# EAGLE design 8bit-quad-fc (EAGLE 8.4.1)
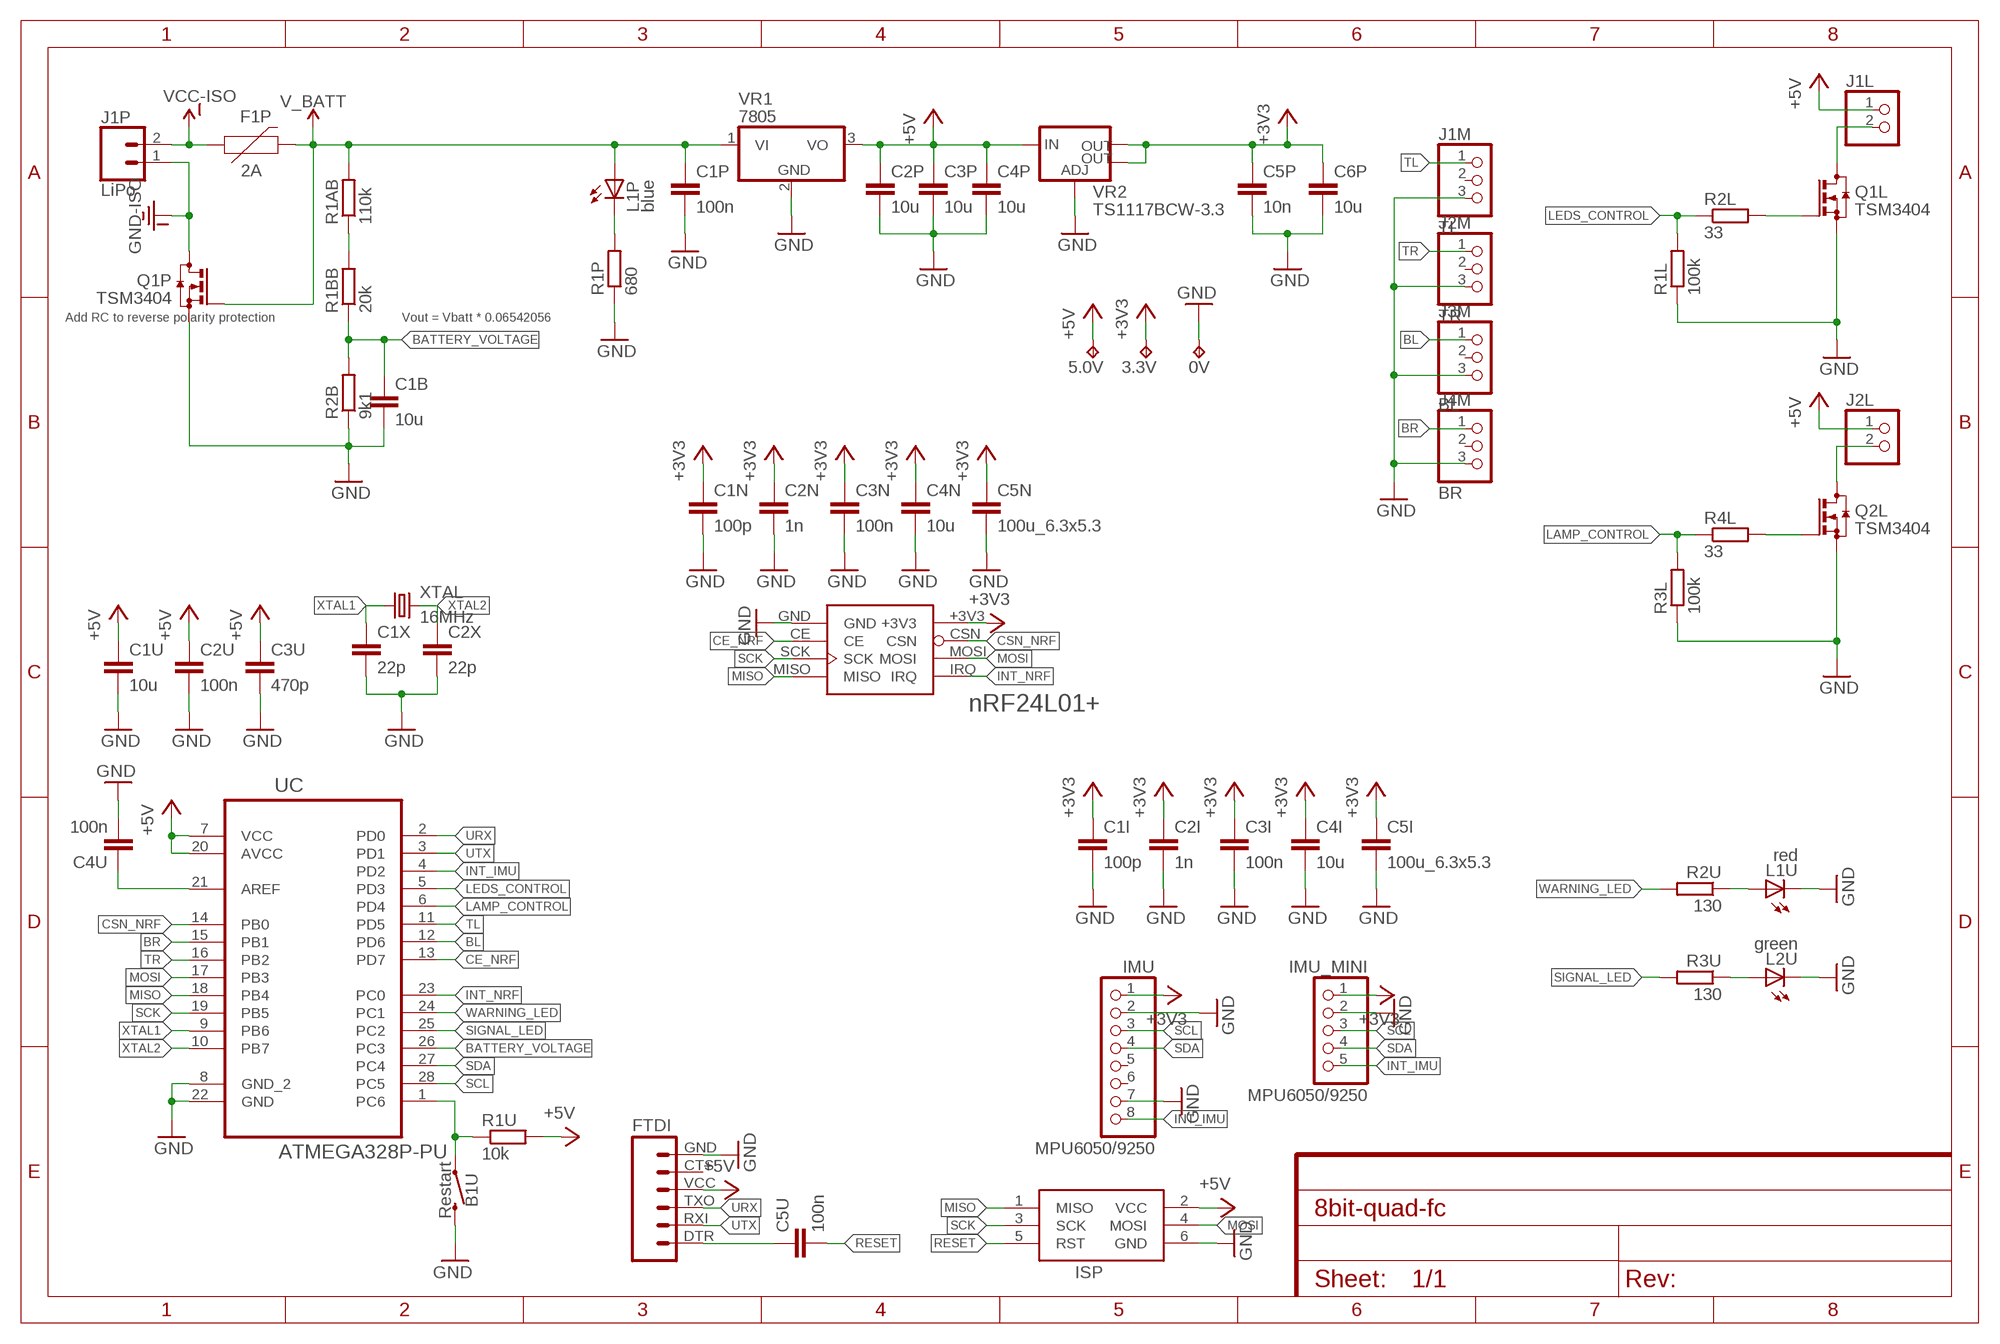
[diagram p0: schematic, sheet 1]

## Parts
0V  TPTP10SQ  [TP10SQ]
3.3V  TPTP10SQ  [TP10SQ]
5.0V  TPTP10SQ  [TP10SQ]
B1U  Restart  MOMENTARY-SWITCH-SPST-PTH-6.0MM  [TACTILE_SWITCH_PTH_6.0MM]
C1B  10u  C-EUC1206  [C1206]
C1I  100p  C-EUC1206  [C1206]
C1N  100p  C-EUC1206  [C1206]
C1P  100n  C-EUC1206  [C1206]
C1U  10u  C-EUC1206  [C1206]
C1X  22p  C-EUC1206  [C1206]
C2I  1n  C-EUC1206  [C1206]
C2N  1n  C-EUC1206  [C1206]
C2P  10u  C-EUC1206  [C1206]
C2U  100n  C-EUC1206  [C1206]
C2X  22p  C-EUC1206  [C1206]
C3I  100n  C-EUC1206  [C1206]
C3N  100n  C-EUC1206  [C1206]
C3P  10u  C-EUC1206  [C1206]
C3U  470p  C-EUC1206  [C1206]
C4I  10u  C-EUC1206  [C1206]
C4N  10u  C-EUC1206  [C1206]
C4P  10u  C-EUC1206  [C1206]
C4U  100n  C-EUC1206  [C1206]
C5I  100u_6.3x5.3  C-EUC3225  [C3225]
C5N  100u_6.3x5.3  C-EUC3225  [C3225]
C5P  10n  C-EUC1206  [C1206]
C5U  100n  C-EUC1206  [C1206]
C6P  10u  C-EUC1206  [C1206]
F1P  2A  PPTC_HALF-AMP  [1206]
FTDI  FTDI_BASICPTH  [FTDI_BASIC]
IMU  MPU6050/9250  PINHD-1X8_2.54  [1X08]
IMU_MINI  MPU6050/9250  PINHD-1X5  [1X05]
ISP  AVRISP-6  [AVRISP]
J1L  PINHD-1X2/90  [1X02/90]
J1M  TL  PINHD-1X3/90  [1X03/90]
J1P  LiPo  CONN_02JST-PTH-2  [JST-2-PTH]
J2L  PINHD-1X2/90  [1X02/90]
J2M  TR  PINHD-1X3/90  [1X03/90]
J3M  BL  PINHD-1X3/90  [1X03/90]
J4M  BR  PINHD-1X3/90  [1X03/90]
L1P  blue  LEDSMT1206  [1206]
L1U  red  LEDSMT1206  [1206]
L2U  green  LEDSMT1206  [1206]
NRF24L01+  nRF24L01+  NRF24L01+_PA_LNA_BREAKOUT_SMD  [NRF24L01+_PA_LNA_SMD]
Q1L  TSM3404  BSS123  [SOT23]
Q1P  TSM3404  BSS123  [SOT23]
Q2L  TSM3404  BSS123  [SOT23]
R1AB  110k  R-EU_R1206  [R1206]
R1BB  20k  R-EU_R1206  [R1206]
R1L  100k  R-EU_R1206  [R1206]
R1P  680  R-EU_R1206  [R1206]
R1U  10k  R-EU_R1206  [R1206]
R2B  9k1  R-EU_R1206  [R1206]
R2L  33  R-EU_R1206  [R1206]
R2U  130  R-EU_R1206  [R1206]
R3L  100k  R-EU_R1206  [R1206]
R3U  130  R-EU_R1206  [R1206]
R4L  33  R-EU_R1206  [R1206]
UC  ATMEGA328P-PU  [DIP254P762X457-28]
VR1  7805  7805TV  [TO220V]
VR2  TS1117BCW-3.3  V_REG_LM1117SOT223  [SOT223]
XTAL  16MHz  CRYSTALHC49S  [HC49/S]

## Nets
+3V3: 3.3V.TP C1I.1 C1N.1 C2I.1 C2N.1 C3I.1 C3N.1 C4I.1 C4N.1 C5I.1 C5N.1 C5P.1 C6P.1 IMU.1 IMU_MINI.1 NRF24L01+.+3V3 VR2.2(OUT) VR2.4(OUT)
+5V: 5.0V.TP C1U.1 C2P.1 C2U.1 C3P.1 C3U.1 C4P.1 FTDI.VCC ISP.2(VCC) J1L.1 J2L.1 R1U.2 UC.7(VCC) UC.20(AVCC) VR1.3(VO) VR2.3(IN)
BATTERY_VOLTAGE: C1B.1 R1BB.1 R2B.2 UC.26(PC3)
BL: J3M.1 UC.12(PD6)
BR: J4M.1 UC.15(PB1)
CE_NRF: NRF24L01+.CE UC.13(PD7)
CSN_NRF: NRF24L01+.CSN UC.14(PB0)
GND: 0V.TP B1U.3 C1B.2 C1I.2 C1N.2 C1P.2 C1U.2 C1X.2 C2I.2 C2N.2 C2P.2 C2U.2 C2X.2 C3I.2 C3N.2 C3P.2 C3U.2 C4I.2 C4N.2 C4P.2 C4U.2 C5I.2 C5N.2 C5P.2 C6P.2 FTDI.GND IMU.2 IMU.7 IMU_MINI.2 ISP.6(GND) J1M.3 J2M.3 J3M.3 J4M.3 L1U.C L2U.C NRF24L01+.GND Q1L.2(S) Q1P.2(S) Q2L.2(S) R1L.1 R1P.1 R2B.1 R3L.1 UC.8(GND_2) UC.22(GND) VR1.2(GND) VR2.1(ADJ)
GND-ISO: J1P.1 Q1P.3(D)
INT_IMU: IMU.8 IMU_MINI.5 UC.4(PD2)
INT_NRF: NRF24L01+.IRQ UC.23(PC0)
LAMP_CONTROL: R3L.2 R4L.1 UC.6(PD4)
LAMP_SINK: J2L.2 Q2L.3(D)
LEDS_CONTROL: R1L.2 R2L.1 UC.5(PD3)
LEDS_SINK: J1L.2 Q1L.3(D)
MISO: ISP.1(MISO) NRF24L01+.MISO UC.18(PB4)
MOSI: ISP.4(MOSI) NRF24L01+.MOSI UC.17(PB3)
N$1: L2U.A R3U.1
N$2: R1AB.1 R1BB.2
N$3: L1U.A R2U.1
N$4: Q1L.1(G) R2L.2
N$6: Q2L.1(G) R4L.2
N$27: L1P.C R1P.2
N$35: C4U.1 UC.21(AREF)
N$36: C5U.1 FTDI.DTR
RESET: B1U.1 C5U.2 ISP.5(RST) R1U.1 UC.1(PC6)
SCK: ISP.3(SCK) NRF24L01+.SCK UC.19(PB5)
SCL: IMU.3 IMU_MINI.3 UC.28(PC5)
SDA: IMU.4 IMU_MINI.4 UC.27(PC4)
SIGNAL_LED: R3U.2 UC.25(PC2)
TL: J1M.1 UC.11(PD5)
TR: J2M.1 UC.16(PB2)
URX: FTDI.TXO UC.2(PD0)
UTX: FTDI.RXI UC.3(PD1)
V_BATT: C1P.1 F1P.2 L1P.A Q1P.1(G) R1AB.2 VR1.1(VI)
VCC-ISO: F1P.1 J1P.2
WARNING_LED: R2U.2 UC.24(PC1)
XTAL1: C1X.1 UC.9(PB6) XTAL.1
XTAL2: C2X.1 UC.10(PB7) XTAL.2
Unconnected: FTDI.CTS IMU.5 IMU.6 J1M.2 J2M.2 J3M.2 J4M.2

## Notes on the sheet
- Add RC to reverse polarity protection | Vout = Vbatt * 0.06542056
- nRF24L01+

## Library data of the parts
0V 3.3V 5.0V = testpad:TP: Test pad
B1U = SparkFun-Switches:MOMENTARY-SWITCH-SPST: Momentary Switch (Pushbutton) - SPST Normally-open (NO) SPST momentary switches (buttons, pushbuttons). Variants PTH-12MM - 12mm square, through-hole Momentary Pushbutton Switch - 12mm Square <https://www.sparkfun.com/products/9190> (COM-09190) PTH-6.0MM, PTH-6.0MM-KIT - 6.0mm square, through-hole Mini Pushbutton Switch <https://www.sparkfun.com/products/97> (COM-00097) KIT package intended for soldering kit's - only one side of pads' copper is exposed. PTH-RIGHT-ANGLE-KIT - Right-angle, through-hole Right Angle Tactile Button <https://www.sparkfun.com/products/10791> - Used on SparkFun BigTime Watch Kit <https://www.sparkfun.com/products/11734> SMD-12MM - 12mm square, surface-mount Tactile Button - SMD (12mm) <https://www.sparkfun.com/products/12993> (COM-12993) Used on SparkFun PicoBoard <https://www.sparkfun.com/products/11888> SMD-4.5MM - 4.5mm Square Trackball Switch Used on SparkFun Blackberry Trackballer Breakout <https://www.sparkfun.com/products/13169> SMD-4.6MMX2.8MM - 4.60mm x 2.80mm, surface mount Used on SparkFun SAMD21 Mini Breakout <https://www.sparkfun.com/products/13664> SMD-5.2MM, SMD-5.2-REDUNDANT - 5.2mm square, surface-mount Mini Pushbutton Switch - SMD <https://www.sparkfun.com/products/8720> (COM-08720) Used on Arduino Pro Mini <https://www.sparkfun.com/products/11114> REDUNDANT package connects both switch circuits together SMD-6.0X3.5MM - 6.0 x 3.5mm, surface mount Momentary Reset Switch SMD <https://www.sparkfun.com/products/8229> (COM-08229) SMD-6.2MM-TALL - 6.2mm square, surface mount Tactile Button - SMD (6mm) <https://www.sparkfun.com/products/12992> Used on SparkFun Digital Sandbox <https://www.sparkfun.com/products/12651> SMD-RIGHT-ANGLE - Right-angle, surface mount Used on SparkFun Block for Intel® Edison - Arduino <https://www.sparkfun.com/products/13036>; PROD_ID: SWCH-08441; SF_SKU: COM-00097
C1B C1I C1N C1P C1U C1X C2N C2P C2U C2X C3N C3P C3U C4N C4P C4U C5I C5N C5P C5U C6P = rcl:C-EU: CAPACITOR, European symbol
C2I C3I C4I = rcl:C-EU: CAPACITOR, European symbol; SPICEPREFIX: C
F1P = SparkFun-Fuses:PPTC: Resettable Fuse PPTC Resettable Fuse. Really a sort of resistor with a polymeric positive temperature coefficient whose resistance increases dramatically with an increase in temperature. When heated by the power passing through the resistance rises causing the current to be limited, protecting the circuit. This is achieved by the transition of the polymer from a crystalline to an amorphous state where the conductive carbon separates breaking the conductive pathways found in the cool crystalline structure. When a PPTC cools back down it resumes conducting letting the circuit turn back on. SparkFun Products: SparkFun RedBoard - Programmed with Arduino <https://www.sparkfun.com/products/12757> Pro Micro - 5V/16MHz <https://www.sparkfun.com/products/12640> Arduino Pro 328 - 5V/16MHz <https://www.sparkfun.com/products/10915> MP3 Trigger <https://www.sparkfun.com/products/13720>; PROD_ID: RES-08585; VALUE: 6V/0.5A
FTDI = SparkFun-Connectors:FTDI_BASIC: FTDI Basic header with labels
IMU = pinhead-1:PINHD-1X8: PIN HEADER
IMU_MINI = pinhead:PINHD-1X5: PIN HEADER
ISP = Adafruit:AVRISP: AVR ISP HEADER Standard 6 pin header for AVR programming
J1L J2L = pinhead:PINHD-1X2: PIN HEADER
J1M J2M J3M J4M = pinhead:PINHD-1X3: PIN HEADER
J1P = SparkFun-Connectors:CONN_02: Multi connection point. Often used as Generic Header-pin footprint for 0.1 inch spaced/style header connections On any of the 0.1 inch spaced packages, you can populate with these: Break Away Headers - Straight <https://www.sparkfun.com/products/116> (PRT-00116) Break Away Male Headers - Right Angle <https://www.sparkfun.com/products/553> (PRT-00553) Female Headers <https://www.sparkfun.com/products/115> (PRT-00115) Break Away Headers - Machine Pin <https://www.sparkfun.com/products/117> (PRT-00117) Break Away Female Headers - Swiss Machine Pin <https://www.sparkfun.com/products/743> (PRT-00743) For SCREWTERMINALS and SPRING TERMINALS visit here: Screw Terimnals on SparkFun.com <https://www.sparkfun.com/search/results?term=Screw+Terminals> (5mm/3.5mm/2.54mm spacing) This device is also useful as a general connection point to wire up your design to another part of your project. Our various solder wires solder well into these plated through hole pads. Hook-Up Wire - Assortment (Stranded, 22 AWG) <https://www.sparkfun.com/products/11375> (PRT-11375) Hook-Up Wire - Assortment (Solid Core, 22 AWG) <https://www.sparkfun.com/products/11367> (PRT-11367) View the entire wire category on our website here <https://www.sparkfun.com/categories/141> Special notes: Molex polarized connector foot print use with: PRT-08233 with associated crimp pins and housings. 2.54_SCREWTERM for use with PRT-10571. 3.5mm Screw Terminal footprints for PRT-08084 5mm Screw Terminal footprints for use with PRT-08432; PROD_ID: CONN-09863; SKU: PRT-09914
L1P L1U L2U = led:LED: LED OSRAM: - CHIPLED LG R971, LG N971, LY N971, LG Q971, LY Q971, LO R971, LY R971 LH N974, LH R974 LS Q976, LO Q976, LY Q976 LO Q996 - Hyper CHIPLED LW Q18S LB Q993, LB Q99A, LB R99A - SideLED LS A670, LO A670, LY A670, LG A670, LP A670 LB A673, LV A673, LT A673, LW A673 LH A674 LY A675 LS A676, LA A676, LO A676, LY A676, LW A676 LS A679, LY A679, LG A679 - Hyper Micro SIDELED® LS Y876, LA Y876, LO Y876, LY Y876 LT Y87S - SmartLED LW L88C, LW L88S LB L89C, LB L89S, LG L890 LS L89K, LO L89K, LY L89K LS L896, LA L896, LO L896, LY L896 - TOPLED LS T670, LO T670, LY T670, LG T670, LP T670 LSG T670, LSP T670, LSY T670, LOP T670, LYG T670 LG T671, LOG T671, LSG T671 LB T673, LV T673, LT T673, LW T673 LH T674 LS T676, LA T676, LO T676, LY T676, LB T676, LH T676, LSB T676, LW T676 LB T67C, LV T67C, LT T67C, LS T67K, LO T67K, LY T67K, LW E67C LS E67B, LA E67B, LO E67B, LY E67B, LB E67C, LV E67C, LT E67C LW T67C LS T679, LY T679, LG T679 LS T770, LO T770, LY T770, LG T770, LP T770 LB T773, LV T773, LT T773, LW T773 LH T774 LS E675, LA E675, LY E675, LS T675 LS T776, LA T776, LO T776, LY T776, LB T776 LHGB T686 LT T68C, LB T68C - Hyper Mini TOPLED® LB M676 - Mini TOPLED Santana® LG M470 LS M47K, LO M47K, LY M47K Source: http://www.osram.convergy.de LUXEON: - LUMILED® LXK2-PW12-R00, LXK2-PW12-S00, LXK2-PW14-U00, LXK2-PW14-V00 LXK2-PM12-R00, LXK2-PM12-S00, LXK2-PM14-U00 LXK2-PE12-Q00, LXK2-PE12-R00, LXK2-PE12-S00, LXK2-PE14-T00, LXK2-PE14-U00 LXK2-PB12-K00, LXK2-PB12-L00, LXK2-PB12-M00, LXK2-PB14-N00, LXK2-PB14-P00, LXK2-PB14-Q00 LXK2-PR12-L00, LXK2-PR12-M00, LXK2-PR14-Q00, LXK2-PR14-R00 LXK2-PD12-Q00, LXK2-PD12-R00, LXK2-PD12-S00 LXK2-PH12-R00, LXK2-PH12-S00 LXK2-PL12-P00, LXK2-PL12-Q00, LXK2-PL12-R00 Source: www.luxeon.com KINGBRIGHT: KA-3528ASYC Source: www.kingbright.com
NRF24L01+ = VaSe7u - Breakouts:NRF24L01+_PA_LNA_BREAKOUT_SMD
Q1L Q1P Q2L = transistor-small-signal:BSS123: N-CHANNEL MOS FET
R1AB R1BB R1L R1P R1U R2B R2L R2U R3L R3U R4L = rcl:R-EU_: RESISTOR, European symbol
UC = Atmel_By_element14_Batch_1-00:ATMEGA328P-PU: 8-bit Microcontroller with In-System Programmable Flash; MPN: ATMEGA328P-PU; OC_FARNELL: 1715487; OC_NEWARK: 15R0268; PACKAGE: PDIP-28; SUPPLIER: Atmel
VR1 = linear:78*: Positive VOLTAGE REGULATOR Source: http://cache.national.com/ds/LM/LM78L05.pdf http://www.fairchildsemi.com/ds/LM/LM7805.pdf
VR2 = SparkFun-IC-Power:V_REG_LM1117: Voltage Regulator LM1117 Standard adjustable voltage regulator but in SMD form. Spark Fun Electronics SKU : COM-00595; PRICE: 0.85BGN; PROD_ID: VREG-08170
XTAL = crystal:CRYSTAL: CRYSTAL; OC_FARNELL: 1667008; OC_NEWARK: unknown

## Board
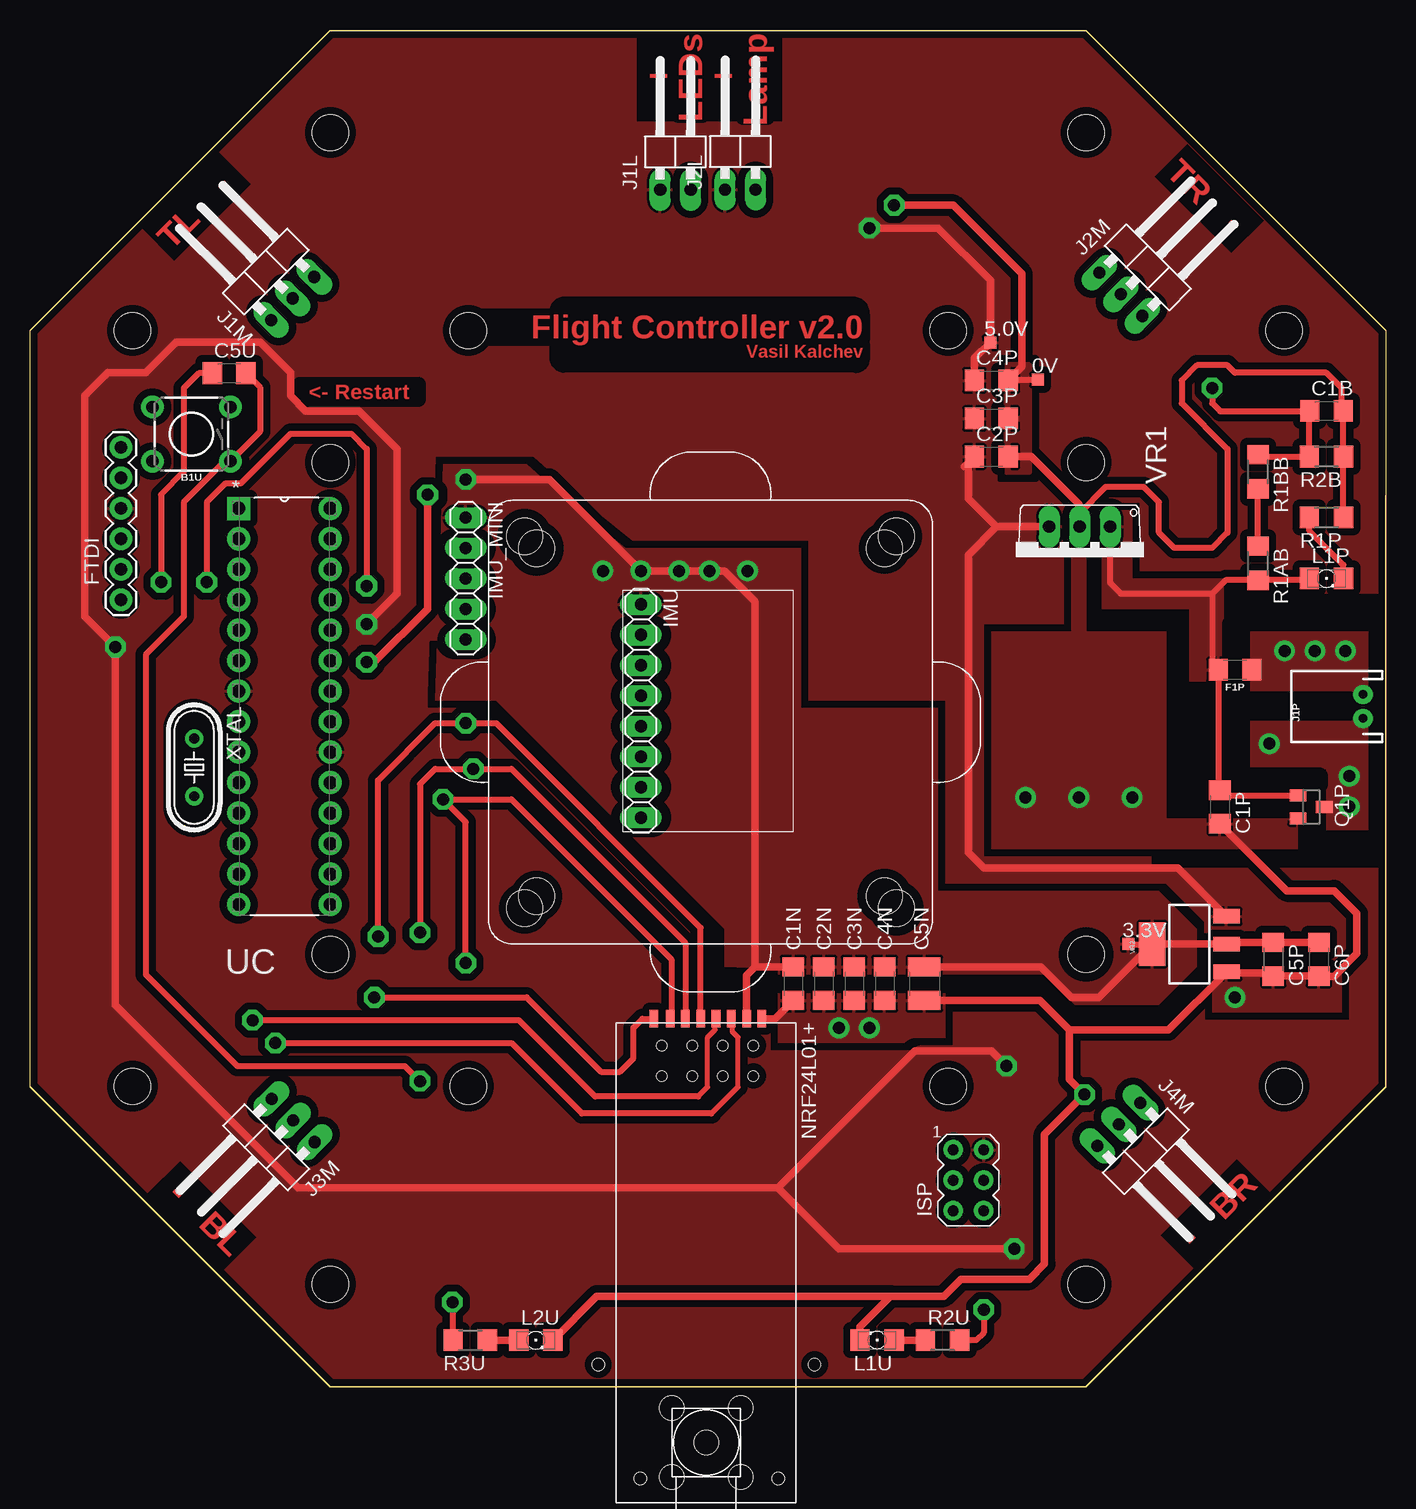
[diagram p1: board, top side]
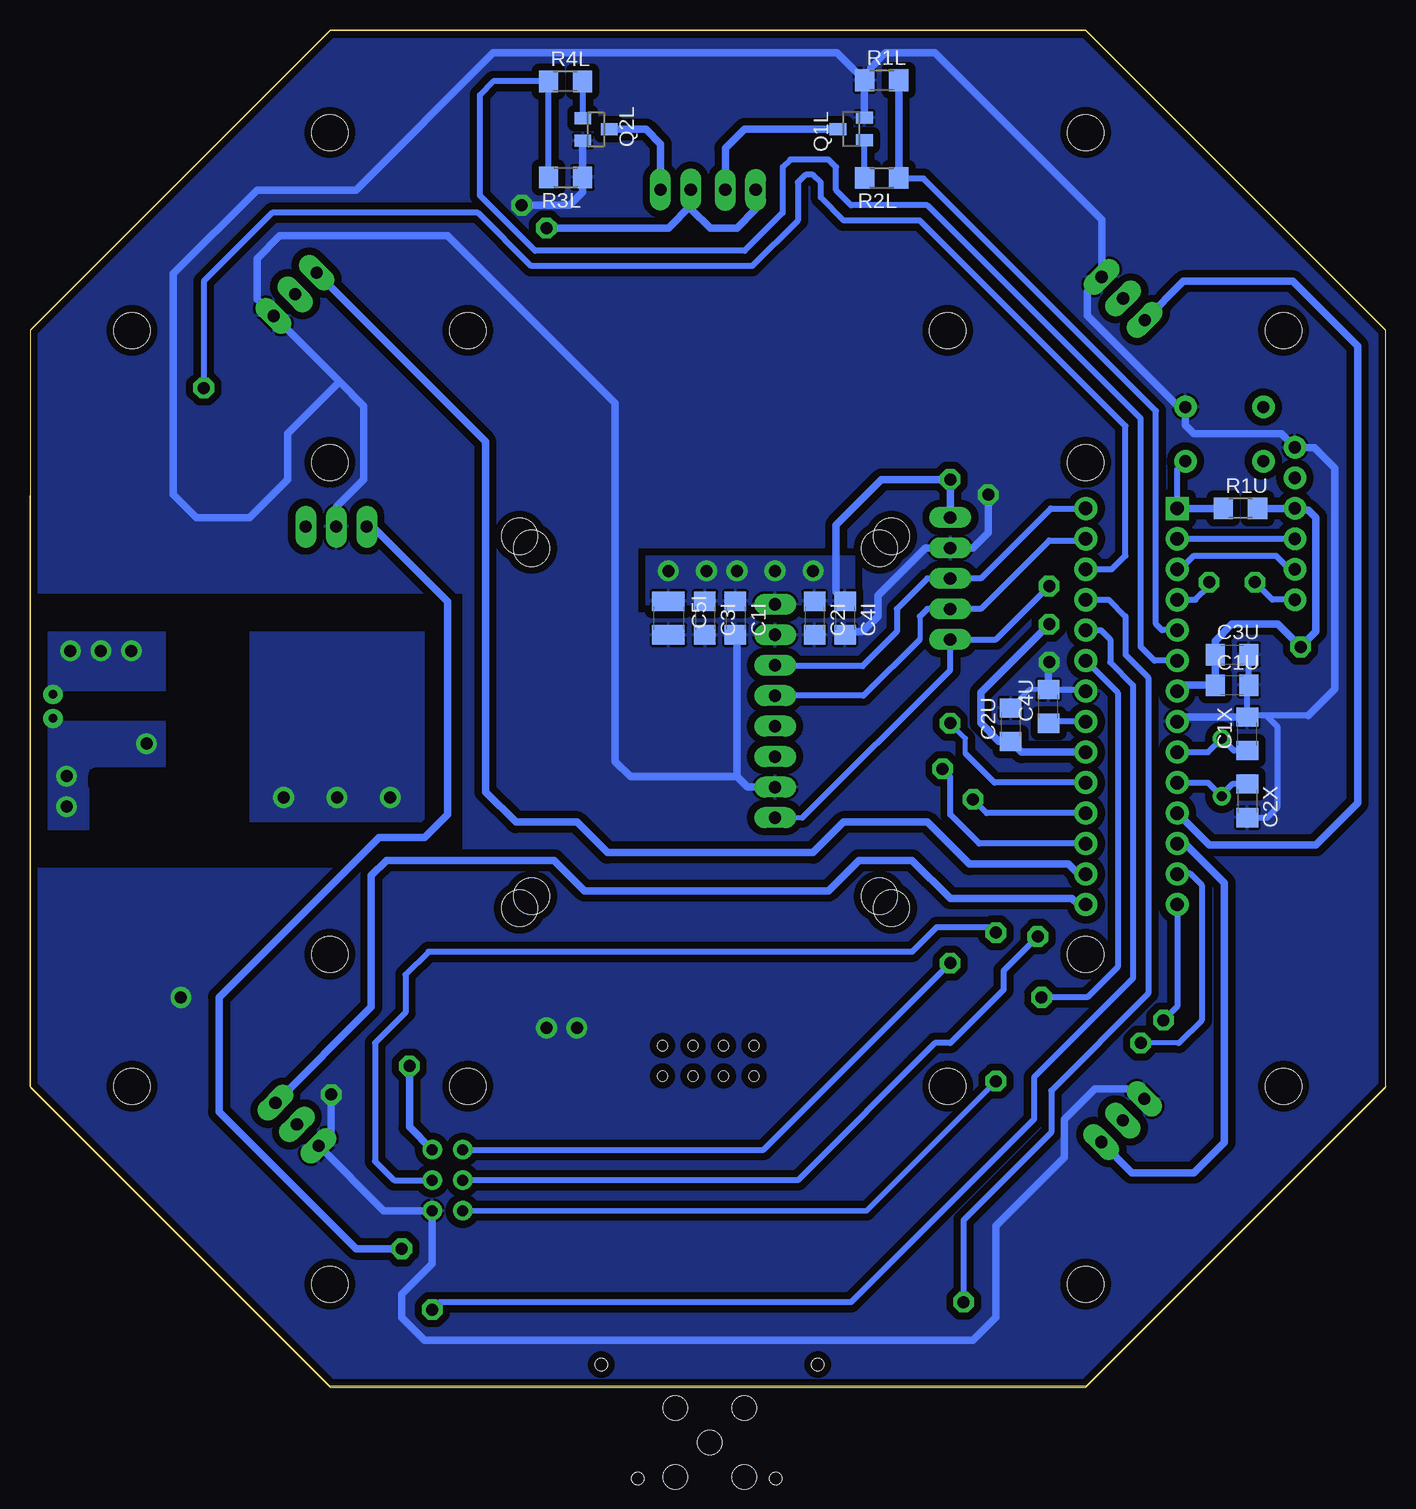
[diagram p2: board, bottom side, seen from below]

Size 113.03 x 113.16 mm. Coordinates in mm from the lower left corner, seen from the top.
Outline: 0,88.14 25.02,113.16 88.01,113.16 113.03,88.14 113.03,25.02 88.01,0 25.02,0 0,25.02 0,88.14
Copper layers (1*16): Top 0.035mm / dielectric 1mm / Bottom 0.035mm
Design rules "VaSe7u - Photo method": minimum track width 16mil, minimum drill 0.8mm, track to track 18mil, track to pad 18mil, pad to pad 18mil, via to via 18mil, smd to smd 10mil, copper to edge 18mil, drill to drill 14mil, minimum pad ring 14mil, minimum via ring 14mil, stop-mask expansion 4mil, vias tented up to drill 0mil, thermal gap 8mil
Holes 1 mm at 47.37,1.91 65.41,1.91
tRestrict: area 100.5,63.9 to 111.9,65.2; area 100.1,51.6 to 100.8,63.6; area 101.7,56.3 to 110,57.3; area 101.7,50.3 to 107.4,50.9; area 106.5,44.3 to 107.1,50.3; area 107.4,44.6 to 112.5,45.2; area 11.7,46.5 to 15.7,56.8
bRestrict: area 100.5,63.9 to 111.9,65.2; area 100.1,51.6 to 100.8,63.6; area 101.7,56.3 to 110,57.3; area 101.7,50.3 to 107.4,50.9; area 106.5,44.3 to 107.1,50.3; area 107.4,44.6 to 112.5,45.2

### Footprints (pad centres in the part's own frame; a part is rotated, then mirrored left to right if it is on the bottom)
TP10SQ = smd 1 x 1: TP 0,0
TACTILE_SWITCH_PTH_6.0MM = drill 1.016 pad 1.88: 1 -3.251,2.261; 2 3.251,2.261; 3 -3.251,-2.261; 4 3.251,-2.261
C1206 = smd 1.6 x 1.8: 1 -1.4,0; 2 1.4,0
C3225 = smd 1.6 x 2.7: 1 -1.4,0; 2 1.4,0
1206 = smd 1.6 x 1.8: 1 -1.4,0; 2 1.4,0
FTDI_BASIC = drill 1.016 pad 1.88: CTS 10.16,0; DTR 0,0; GND 12.7,0; RXI 2.54,0; TXO 5.08,0; VCC 7.62,0
1X08 = drill 1.016 long: 1 -8.89,0; 2 -6.35,0; 3 -3.81,0; 4 -1.27,0; 5 1.27,0; 6 3.81,0; 7 6.35,0; 8 8.89,0
1X05 = drill 1.016 long: 1 -5.08,0; 2 -2.54,0; 3 0,0; 4 2.54,0; 5 5.08,0
AVRISP = drill 0.9 pad 1.626: 1 -1.27,2.54; 2 1.27,2.54; 3 -1.27,0; 4 1.27,0; 5 -1.27,-2.54; 6 1.27,-2.54
1X02/90 = drill 1.016 long: 1 -1.27,-3.81; 2 1.27,-3.81
1X03/90 = drill 1.016 long: 1 -2.54,-3.81; 2 0,-3.81; 3 2.54,-3.81
JST-2-PTH = drill 0.7 pad 1.6: 1 -1,0; 2 1,0
1206' = smd 1.6 x 1.803: A -1.422,0; C 1.422,0
NRF24L01+_PA_LNA_SMD = smd 1.422 x 0.711: +3V3 -0.334,10.857; CE -0.334,9.585; CSN -0.334,8.313; GND -0.334,12.13; IRQ -0.334,3.111; MISO -0.334,4.497; MOSI -0.334,5.769; SCK -0.334,7.042 | hole 2: 35,7.5; 37.873,4.627; 37.873,10.373; 32.127,10.373; 32.127,4.627 | hole 1: 38,2; 38,13.5 | hole 0.85: 1.905,11.43; 4.445,11.43; 4.445,8.89; 1.905,8.89; 1.905,6.35; 1.905,3.81; 4.445,3.81; 4.445,6.35
SOT23 = smd 1 x 1.4: 1 -0.95,-1.1; 2 0.95,-1.1; 3 0,1.1
R1206 = smd 1.6 x 1.803: 1 -1.422,0; 2 1.422,0
F450_TOP_PLATE = hole 3: -31.48,-48.04; 31.52,-48.04; -31.48,-20.54; 31.52,-20.54; -47.98,-31.54; -19.98,-31.54; 20.02,-31.54; 48.02,-31.54; 31.52,47.96; 31.52,20.46; 20.02,31.46; 48.02,31.46; -31.48,47.96; -31.48,20.46; -47.98,31.46; -19.98,31.46
ANTI-VIBRATION_PLATE = hole 3: 3,3; 4,4; 34,3; 33,4; 34,34; 33,33; 3,34; 4,33
DIP254P762X457-28 = drill 1.118 square: 1 -7.62,33.02 | drill 1.118: 2 -7.62,30.48; 3 -7.62,27.94; 4 -7.62,25.4; 5 -7.62,22.86; 6 -7.62,20.32; 7 -7.62,17.78; 8 -7.62,15.24; 9 -7.62,12.7; 10 -7.62,10.16; 11 -7.62,7.62; 12 -7.62,5.08; 13 -7.62,2.54; 14 -7.62,0; 15 0,0; 16 0,2.54; 17 0,5.08; 18 0,7.62; 19 0,10.16; 20 0,12.7; 21 0,15.24; 22 0,17.78; 23 0,20.32; 24 0,22.86; 25 0,25.4; 26 0,27.94; 27 0,30.48; 28 0,33.02
TO220V = drill 1.016 long: 1 -2.54,-2.54; 2 0,-2.54; 3 2.54,-2.54
SOT223 = smd 1.219 x 2.235: 1 -2.311,-3.099; 2 0,-3.099; 3 2.311,-3.099 | smd 3.6 x 2.2: 4 0,3.099
HC49/S = drill 0.813: 1 -2.413,0; 2 2.413,0

### Placement (x,y rotation side)
0V  84.01,84.01 0 top
3.3V  91.57,36.96 0 top
5.0V  80.04,87.09 0 top
B1U  13.46,79.47 180 top
C1B  108.08,81.41 0 top
C1I  54.23,64.13 270 bottom
C1N  63.63,33.66 270 top
C1P  99.19,48.39 270 top
C1U  12.83,58.55 0 bottom
C1X  11.56,54.48 90 bottom
C2I  47.62,64.13 270 bottom
C2N  66.17,33.66 270 top
C2P  80.14,77.6 0 top
C2U  31.27,55.25 90 bottom
C2X  11.56,48.9 270 bottom
C3I  56.77,64.13 270 bottom
C3N  68.71,33.66 270 top
C3P  80.14,80.77 0 top
C3U  12.83,61.09 0 bottom
C4I  45.09,64.13 270 bottom
C4N  71.25,33.66 270 top
C4P  80.14,83.95 0 top
C4U  28.13,56.77 90 bottom
C5I  59.82,64.13 270 bottom
C5N  74.55,33.66 270 top
C5P  103.63,35.69 270 top
C5U  16.61,84.55 0 top
C6P  107.44,35.69 270 top
F1P  100.46,59.82 180 top
FTDI  7.59,65.66 90 top
IMU  50.93,56.39 270 top
IMU_MINI  36.32,67.44 270 top
ISP  78.23,17.27 0 top
J1L  53.81,103.64 0 top
J1M  19.21,93.47 45 top
J1P  111.12,56.77 90 top
J2L  59.21,103.66 0 top
J2M  93.63,93.82 315 top
J3M  19.24,19.56 135 top
J4M  93.47,19.24 225 top
L1P  blue  [1206']  108.08,67.44 0 top
L1U  red  [1206']  70.61,3.94 180 top
L2U  green  [1206']  42.16,3.94 0 top
NRF24L01+  48.87,30.41 270 top
Q1L  44.58,104.9 90 bottom
Q1P  106.81,48.39 270 top
Q2L  65.85,104.87 270 bottom
R1AB  102.36,68.71 270 top
R1BB  102.36,76.33 270 top
R1L  42.04,108.97 0 bottom
R1P  108.08,72.52 180 top
R1U  12.13,73.28 0 bottom
R2B  108.08,77.6 180 top
R2L  42.04,100.84 180 bottom
R2U  76.07,3.94 0 top
R3L  68.39,100.87 180 bottom
R3U  36.7,3.94 180 top
R4L  68.39,108.87 0 bottom
U$2  F450_TOP_PLATE  [F450_TOP_PLATE]  56.52,56.64 0 top
U$3  ANTI-VIBRATION_PLATE  [ANTI-VIBRATION_PLATE]  38.23,36.96 0 top
UC  25.02,40.26 0 top
VR1  87.5,69.21 180 top
VR2  96.65,36.96 90 top
XTAL  13.68,51.69 270 top

### Tracks (layer width: path | path; a pad name or v marks a point on that pad's centre or on a via)
+3V3  (via drill 1)
  Top 0.508: 59.82,34.42 59.73,34.33 | 3.3V.TP 91.6,36.92 93.51,36.92
  Top 0.61: C6P.1 C5P.1 99.88,37.09 VR2.2 VR2.4 93.51,36.92 89.1,32.51 86.8,32.51 84.27,35.05 C5N.1 | NRF24L01+.+3V3 59.73,34.33 | C1N.1 60.46,35.05 | 59.82,34.42 60.46,35.05 | 60.46,35.05 60.45,35.06 | 60.46,35.05 60.46,65.53 57.91,68.07 v56.64,68.07 v54.1,68.07 v50.93,68.07 43.31,75.69 v36.32,75.69
  Bottom 0.61: IMU_MINI.1 v36.32,75.69 42.04,75.69 45.85,71.88 45.85,66.3 C4I.1
  other vias: 47.75,68.07 59.82,68.07
  pour Top (isolate 0.762): 62.36,36.64 76.33,36.64 76.33,34.42 62.36,34.42
  pour Bottom: 44.26,65.21 61.72,65.21 61.72,69.34 44.26,69.34
  pour Top (isolate 0.762, rank 3): 97.28,35.05 94.11,31.88 87.12,31.88 84.58,34.42 73.79,34.42 57.91,35.05 57.91,38.23 38.86,57.28 33.78,57.28 34.42,76.96 41.4,76.96 arc5 49.66,69.98 64.26,69.98 64.26,56.64 75.69,56.64 75.69,41.4 94.11,41.4 97.28,38.23
+5V  (via drill 1)
  Top 0.508: 78.7,83.91 C4P.1
  Top 0.61: 78.25,77.11 77.91,76.77 | 78.25,77.11 C2P.1 | VR2.3 95.71,43.31 79.5,43.31 78.23,44.58 78.23,69.41 80.58,71.75 | 80.58,71.75 78.25,74.09 78.25,77.11 | v69.98,96.65 75.69,96.65 80.04,92.3 5.0V.TP 78.74,85.79 C4P.1 | v28.07,63.63 30.61,66.17 30.61,78.23 27.43,81.41 22.99,81.41 21.72,82.68 21.72,84.58 19.18,87.12 12.19,87.12 9.65,84.58 6.48,84.58 4.57,82.68 4.57,64.26 v7.11,61.72 7.11,31.88 22.35,16.64 62.36,16.64 | 62.36,16.64 73.79,28.07 80.14,28.07 v81.41,26.8 | 62.36,16.64 67.44,11.56 v82.04,11.56 | 80.58,71.75 VR1.3
  Bottom 0.61: R1U.2 FTDI.VCC 7.46,73.15 6.48,73.15 5.84,72.52 5.84,62.99 v7.11,61.72 9.02,63.63 12.83,63.63 14.23,62.23 C3U.1 C1U.1 16.89,58.55 UC.7 | J1L.1 52.54,98.21 54.1,96.65 56.32,96.65 57.91,98.23 57.91,98.55 | J2L.1 57.91,99.82 57.91,98.55 | v69.98,96.65 59.82,96.65 57.91,98.55 | 31.78,53.85 C2U.1 | UC.20 30.39,52.96 C2U.1 | C2U.1 32.26,53.85 33.78,55.37 33.78,57.91 v28.07,63.63 | v81.41,26.8 81.41,21.72 ISP.2 | v82.04,11.56 85.85,11.56 97.28,22.99 97.28,32.51 83.95,45.85 80.14,45.85 78.23,47.75 78.23,65.53 84.45,71.75 VR1.3
  pour Top (isolate 0.762): 78.87,85.22 77.6,85.22 77.6,76.33 78.87,76.33
  pour Top (isolate 0.762): 78.87,74.42 82.68,74.42 85.53,72.2 85.53,64.9 77.6,64.9 77.6,76.96 78.87,76.96
  pour Top (isolate 0.61, rank 6): -1.78,88.39 24.89,115.06 115.06,115.06 115.06,66.17 93.47,66.17 93.47,43.31 115.06,43.31 115.06,24.26 89.03,-1.78 24.26,-1.78 -1.78,24.26
BATTERY_VOLTAGE  (via drill 1)
  Top 0.508: 106.66,81.38 R2B.2 102.51,77.6 R1BB.1 | 106.66,81.38 C1B.1 | 106.66,81.38 99.21,81.38 98.55,82.04 v98.55,83.31
  Bottom 0.508: UC.26 22.86,68.2 21.72,69.34 21.72,80.14 38.86,97.28 45.21,97.28 47.12,99.19 47.12,100.46 47.75,101.09 48.39,101.09 49.02,100.46 49.02,97.28 52.83,93.47 71.25,93.47 75.69,97.92 92.84,97.92 98.55,92.2 v98.55,83.31
BL
  Bottom 0.61: UC.12 16.76,45.34 13.46,42.04 13.46,20.45 16,17.91 21.18,17.91 J3M.1
BR
  Bottom 0.406: 25.08,40.26 UC.15
  Bottom 0.61: J4M.1 84.58,31.72 84.58,42.67 83.31,43.94 69.34,43.94 66.8,41.4 46.48,41.4 43.94,43.94 39.5,43.94 36.32,40.77 26.16,40.77 25.65,40.26 UC.15
CE_NRF  (via drill 1)
  Top 0.406: 56.8,22.83 59.02,25.05 59.02,29.18 58.55,29.65 58.55,30.65 NRF24L01+.CE
  Top 0.508: 56.8,22.83 46.01,22.83 40.13,28.7 v20.45,28.7
  Bottom 0.406: 17.37,42.83 UC.13 | 17.27,28.7 v20.45,28.7
  Bottom 0.508: 17.37,42.83 16.32,42.83 15.37,41.88 15.37,30.61 17.27,28.7
CSN_NRF  (via drill 1)
  Top 0.406: 55.69,24.26 56.48,25.05 56.48,29.18 57.12,29.81 57.12,30.67 NRF24L01+.CSN
  Top 0.508: v18.54,30.61 40.77,30.61 47.12,24.26 55.69,24.26
  Bottom 0.508: UC.14 17.4,31.75 v18.54,30.61
GND  (via drill 1)
  Top 0.406: VR2.1 100.1,34.29 | C6P.2 107.47,34.26 | 81.6,84.01 C4P.2 | 109.5,81.38 C1B.2
  Top 0.508: 81.6,84.01 0V.TP | C1B.2 109.35,81.54 109.35,83.31 108.08,84.58 100.46,84.58 99.82,85.22 97.28,85.22 96.01,83.95 96.01,82.04 99.82,78.23 99.82,71.25 98.55,69.98 95.38,69.98 94.11,71.25 94.11,73.79 92.84,75.06 89.66,75.06 87.5,72.9 VR1.2 | R1P.1 R2B.1 109.5,81.38
  Top 0.61: C2P.2 83.47,77.6 87.44,73.63 87.44,71.82 VR1.2 | NRF24L01+.GND 62.11,30.74 C1N.2 | C1P.2 104.77,41.4 108.71,41.4 110.62,39.5 110.62,36.16 108.71,34.26 107.47,34.26 | C5N.2 84.2,32.26 86.65,29.81 | 86.65,29.81 94.91,29.81 99.67,34.57 | 99.67,34.57 VR2.1 | v28.07,60.45 28.7,60.45 33.15,64.9 v33.15,74.42 | C6P.2 C5P.2 103.35,34.57 99.67,34.57 | v72.04,98.55 76.96,98.55 82.68,92.84 82.68,85.09 C4P.2 | 86.65,29.81 86.65,25.69 v87.92,24.42 84.58,21.08 84.58,10.29 83.31,9.02 77.6,9.02 76.17,7.59 71.73,7.59 | L2U.C 47.24,7.59 71.73,7.59 | L1U.C 69.19,5.05 71.73,7.59
  Bottom 0.406: 28,58.04 C4U.2 29.75,58.17 C2U.2 | 54.1,62.61 C1I.2 | 11.43,56.01 9.97,56.01
  Bottom 0.508: C3U.2 C1U.2 11.56,58.42 C1X.2 11.43,56.01 6.48,56.01 | C4U.2 25.15,58.17 | C2X.2 9.91,47.5 9.02,48.39 9.02,55.05 9.97,56.01
  Bottom 0.61: IMU.7 53.21,50.04 54.1,50.93 | 54.1,50.93 54.1,62.61 | Q1L.2 43.48,108.95 R1L.1 | 88.98,20.17 83.54,14.73 ISP.6 79.5,10.29 82.04,7.75 82.04,5.84 80.14,3.94 34.42,3.94 32.51,5.84 32.51,13.46 26.8,19.18 26.8,22.35 24.26,24.89 21.08,24.89 20.24,24.05 J3M.3 | R3L.1 66.97,103.9 Q2L.2 | 23.73,92.57 J1M.3 | 25.15,58.17 UC.22 | 87.23,83.83 85.22,81.81 85.22,75.69 87.5,73.41 VR1.2 | 87.23,83.83 J2M.3 94.11,90.7 94.11,94.11 92.2,96.01 78.23,96.01 64.26,82.04 64.26,52.2 62.99,50.93 54.1,50.93 | 66.74,101.09 R3L.1 | R1L.1 45.75,111.25 74.42,111.25 85.85,99.82 94.11,99.82 101.09,92.84 101.09,74.42 99.19,72.52 94.74,72.52 91.57,75.69 91.57,79.5 87.23,83.83 | R1L.1 42.99,109.44 42.99,109.98 41.72,111.25 37.59,111.25 23.7,97.36 J1M.3 | C4I.2 44.83,62.99 43.62,62.99 42.35,64.26 42.35,66.01 38.39,69.98 IMU_MINI.2 34.42,69.98 33.15,71.25 v33.15,74.42 | C4U.2 28.13,60.39 v28.07,60.45 | R3L.1 66.97,99.66 68.07,98.55 v72.04,98.55 | J4M.3 88.98,20.17 | 88.98,20.17 87.92,21.24 v87.92,24.42 | C1X.2 17.02,55.88 UC.8 | 6.48,56.01 4.25,58.23 4.25,76.64 5.97,78.36 FTDI.GND 8.73,79.5 16,79.5 16.71,80.21 B1U.3 17.28,81.73 24.89,89.34 24.89,91.38 J1M.3
  other vias: 87.44,49.18 82.99,49.18 91.88,49.18 67.44,29.97 69.98,29.97 100.46,32.51
  pour Top (isolate 0.762): 86.8,73.15 88.07,73.15 88.07,62.99 94.74,62.99 94.74,47.43 105.85,47.43 105.85,44.89 80.14,44.89 80.14,62.99 86.8,62.99
  pour Top (isolate 0.762): 83.31,76.33 83.31,85.22 81.41,85.22 81.41,76.33
  pour Top (isolate 0.762): 62.36,32.83 76.33,32.83 76.33,28.7 62.36,28.7
  pour Bottom: 44.26,62.99 61.72,62.99 61.72,61.4 53.47,61.4 52.83,62.04 44.26,62.04
  pour Bottom (isolate 0.762): 80.14,62.99 94.74,62.99 94.74,47.12 80.14,47.12
  pour Bottom (isolate 0.61, rank 6): 89.03,114.43 114.43,88.39 114.43,66.17 76.96,66.17 76.96,43.31 114.43,43.31 114.43,24.26 89.03,-1.14 24.26,-1.14 -1.14,24.26 -1.14,114.43
  pour Top (isolate 0.61): 98.55,34.42 109.35,34.42 109.35,31.24 98.55,31.24
GND-ISO  (via drill 1)
  other vias: 109.98,48.42 103.31,53.66 109.98,50.96
  pour Top (isolate 0.762, no thermals): 111.57,56.32 111.57,46.48 108.08,46.48 108.08,51.56 101.73,51.56 101.73,55.69 110.62,55.69
  pour Bottom (isolate 0.762, no thermals): 111.57,56.32 111.57,46.48 108.08,46.48 108.08,51.56 101.73,51.56 101.73,55.69 110.62,55.69
INT_IMU  (via drill 1)
  Top 0.508: v28.07,66.8 28.07,78.23 26.8,79.5 21.72,79.5 17.59,75.38 16.32,75.38 14.73,73.79 v14.73,67.12
  Bottom 0.406: IMU.8 48.64,47.5 | 14.73,66.8 v14.73,67.12
  Bottom 0.508: v28.07,66.8 32.51,62.36 IMU_MINI.5 36.32,59.82 48.64,47.5 | UC.4 15.88,65.66 14.73,66.8
INT_NRF  (via drill 1)
  Top 0.508: 52.04,30.79 NRF24L01+.IRQ 51.06,30.74 50.29,29.97 50.29,27.43 49.18,26.32 47.59,26.32 41.4,32.51 v28.7,32.51
  Bottom 0.508: UC.23 22.35,57.91 22.35,35.05 24.89,32.51 v28.7,32.51
LAMP_CONTROL
  Bottom 0.508: UC.6 19.3,60.58 20.45,61.72 20.45,80.77 38.23,98.55 44.58,98.55 45.85,99.82 45.85,101.73 46.48,102.36 49.66,102.36 50.29,101.73 50.29,97.92 53.47,94.74 70.93,94.74 75.53,99.35 75.53,107.76 74.42,108.87 R4L.1 R3L.2 69.82,100.86
LAMP_SINK
  Bottom 0.61: Q2L.3 61.69,104.87 60.45,103.63 60.45,99.88 J2L.2
LEDS_CONTROL
  Bottom 0.406: 40.46,100.77 40.62,100.93
  Bottom 0.508: UC.5 18.67,63.12 19.18,63.63 19.18,81.41 38.54,100.77 40.46,100.77
  Bottom 0.61: R2L.1 40.62,100.93 R1L.2
LEDS_SINK
  Bottom 0.61: Q1L.3 53.47,104.9 55.08,103.29 J1L.2
MISO  (via drill 1)
  Top 0.508: NRF24L01+.MISO 53.47,30.83 53.47,35.69 40.13,49.02 v34.42,49.02 36.32,47.12 v36.32,35.37
  Bottom 0.508: UC.18 33.27,47.88 v34.42,49.02 | ISP.1 51.88,19.81 v36.32,35.37
MOSI  (via drill 1)
  Top 0.508: NRF24L01+.MOSI 54.64,37.05 40.13,51.56 v36.96,51.56 33.78,51.56 32.51,50.29 v32.51,37.91
  Bottom 0.508: UC.17 33.91,45.34 36.32,47.75 36.32,50.93 v36.96,51.56 | ISP.4 82.68,17.27 84.27,18.86 84.27,28.7 81.72,31.24 81.72,34.42 79.82,36.32 39.5,36.32 37.43,38.39 32.99,38.39 v32.51,37.91
N$1
  Top 0.61: R3U.1 L2U.A
N$2
  Top 0.508: R1AB.1 R1BB.2
N$3
  Top 0.61: R2U.1 L1U.A
N$4
  Bottom 0.406: 43.46,103.93 Q1L.1
  Bottom 0.508: R2L.2 43.46,103.93
N$5
  cutout Top (isolate 0.762): 44.58,84.58 68.71,84.58 arc90 69.98,85.53 69.98,89.5 arc90 68.71,90.93 44.58,90.93 arc90 43.31,89.66 43.31,85.85 arc90
N$6
  Bottom 0.406: 66.95,108.85 R4L.2
  Bottom 0.508: Q2L.1 66.95,108.85
N$7
  cutout Top: 50.61,112.52 50.61,105.54 62.67,105.54 62.67,112.52
N$8
  cutout Top: 9.81,16.16 12.51,18.86 18.86,12.51 16.16,9.81
  cutout Top: 93.79,100.93 96.49,103.63 102.84,97.28 100.14,94.58
  cutout Top: 96.96,9.97 94.27,12.67 100.62,19.02 103.31,16.32
  cutout Top: 12.03,93.95 9.33,96.65 15.68,103 18.38,100.3
N$27
  Top 0.508: 109.35,67.59 L1P.C 109.5,68.55 106.66,71.4 R1P.2
N$35
  Bottom 0.508: UC.21 28,55.5 C4U.1
N$36  (via drill 1)
  Top 0.508: v10.92,67.12 10.92,74.42 12.83,76.33 12.83,83.31 14.07,84.55 C5U.1
  Bottom 0.508: FTDI.DTR 9.46,65.66 v10.92,67.12
RESET  (via drill 1)
  Top 0.508: v32.51,25.53 31.24,26.8 17.27,26.8 9.65,34.42 9.65,61.09 12.83,64.26 12.83,73.79 16.25,77.21 B1U.1 19.18,79.67 19.18,83.38 C5U.2
  Bottom 0.406: v32.51,25.53 43.31,14.73
  Bottom 0.457: 43.31,14.73 ISP.5
  Bottom 0.508: UC.1 17.4,76.52 B1U.1
  Bottom 0.61: UC.1 R1U.1
SCK  (via drill 1)
  Top 0.508: NRF24L01+.SCK 55.91,38.32 38.86,55.37 v36.32,55.37 33.78,55.37 29.02,50.61 v29.02,37.59
  Bottom 0.406: 35.05,52.83 35.05,54.1 v36.32,55.37
  Bottom 0.508: UC.19 32.64,50.42 35.05,52.83 | ISP.3 49.02,17.27 37.59,28.7 36.32,28.7 31.88,33.15 31.88,34.73 v29.02,37.59
SCL
  Bottom 0.406: 50.86,60.14 IMU.3
  Bottom 0.508: UC.28 27.94,73.28 33.78,67.44 IMU_MINI.3 38.23,67.44 40.77,64.9 40.77,62.99 43.62,60.14 50.86,60.14
SDA
  Bottom 0.406: 25.15,70.61 UC.27 | 38.86,64.26 38.86,62.36
  Bottom 0.508: 25.15,70.61 28.07,70.61 33.78,64.9 IMU_MINI.4 38.23,64.9 38.86,64.26 | 38.86,62.36 43.56,57.66 IMU.4
SIGNAL_LED  (via drill 1)
  Top 0.406: 35.21,4.01 R3U.2
  Top 0.508: v35.21,7.11 35.21,4.01
  Bottom 0.508: UC.25 23.11,65.66 21.72,64.26 21.72,61.09 19.81,59.18 19.81,32.83 27.91,24.73 27.91,21.24 35.21,13.94 v35.21,7.11
TL
  Bottom 0.61: UC.11 14.73,45.21 5.84,45.21 2.35,48.71 2.35,86.8 7.75,92.2 16.89,92.2 J1M.1
TR
  Bottom 0.61: J2M.1 75.06,78.84 75.06,49.66 72.52,47.12 67.44,47.12 64.9,44.58 47.75,44.58 45.21,47.12 38.23,47.12 34.73,43.62 26.48,43.62 25.65,42.8 UC.16
URX
  Bottom 0.508: FTDI.TXO UC.2
UTX
  Bottom 0.406: UC.3 17.14,68.2 | 8.06,68.23 7.62,68.23 FTDI.RXI
  Bottom 0.508: 8.06,68.23 9.18,69.34 16,69.34 17.14,68.2
V_BATT
  Top 0.457: L1P.A 106.5,67.28
  Top 0.508: Q1P.1 99.64,49.34 C1P.1 99.06,49.92 F1P.2 98.55,60.32 98.55,66.17 | 106.5,67.28 R1AB.2 99.67,67.28 98.55,66.17 | 98.55,66.17 90.93,66.17 90.04,67.06 VR1.1
  pour Top (isolate 0.762): 99.5,58.86 99.5,67.44 91.88,67.44 91.88,73.15 89.34,73.15 89.34,64.9 96.65,64.9 96.65,58.86
VCC-ISO  (via drill 1)
  other vias: 104.58,61.4 107.12,61.4 109.66,61.4
  pour Top (isolate 0.762, no thermals): 111.57,57.28 111.57,62.99 101.73,62.99 101.73,57.91 110.3,57.91
  pour Bottom (isolate 0.762, no thermals): 111.57,57.28 111.57,62.99 101.73,62.99 101.73,57.91 110.3,57.91
WARNING_LED  (via drill 1)
  Top 0.508: 77.49,4.04 R2U.2 78.87,3.94 79.5,4.57 v79.5,6.48
  Bottom 0.508: UC.24 23.75,63.12 22.99,62.36 22.99,60.45 21.08,58.55 21.08,34.1 29.34,25.84 29.34,22.35 44.58,7.11 78.87,7.11 v79.5,6.48
XTAL1
  Bottom 0.508: UC.9 14.83,52.96 XTAL.1 12.67,53.08 C1X.1
XTAL2
  Bottom 0.406: 13.76,49.36 XTAL.2
  Bottom 0.508: UC.10 14.83,50.42 13.76,49.36 12.82,50.3 C2X.1

### Text on the board
Top: + | LEDs | + | Lamp | - | TR | TL | - | Flight Controller v2.0 | Vasil Kalchev | <- Restart | - | BR | BL | -
tStop: + | LEDs | + | Lamp | - | TR | TL | - | Flight Controller v2.0 | Vasil Kalchev | <- Restart | - | BR | BL | -
Document: change connector